# EAGLE design just_a_switch-mk-2.2 (EAGLE 6.5.0)
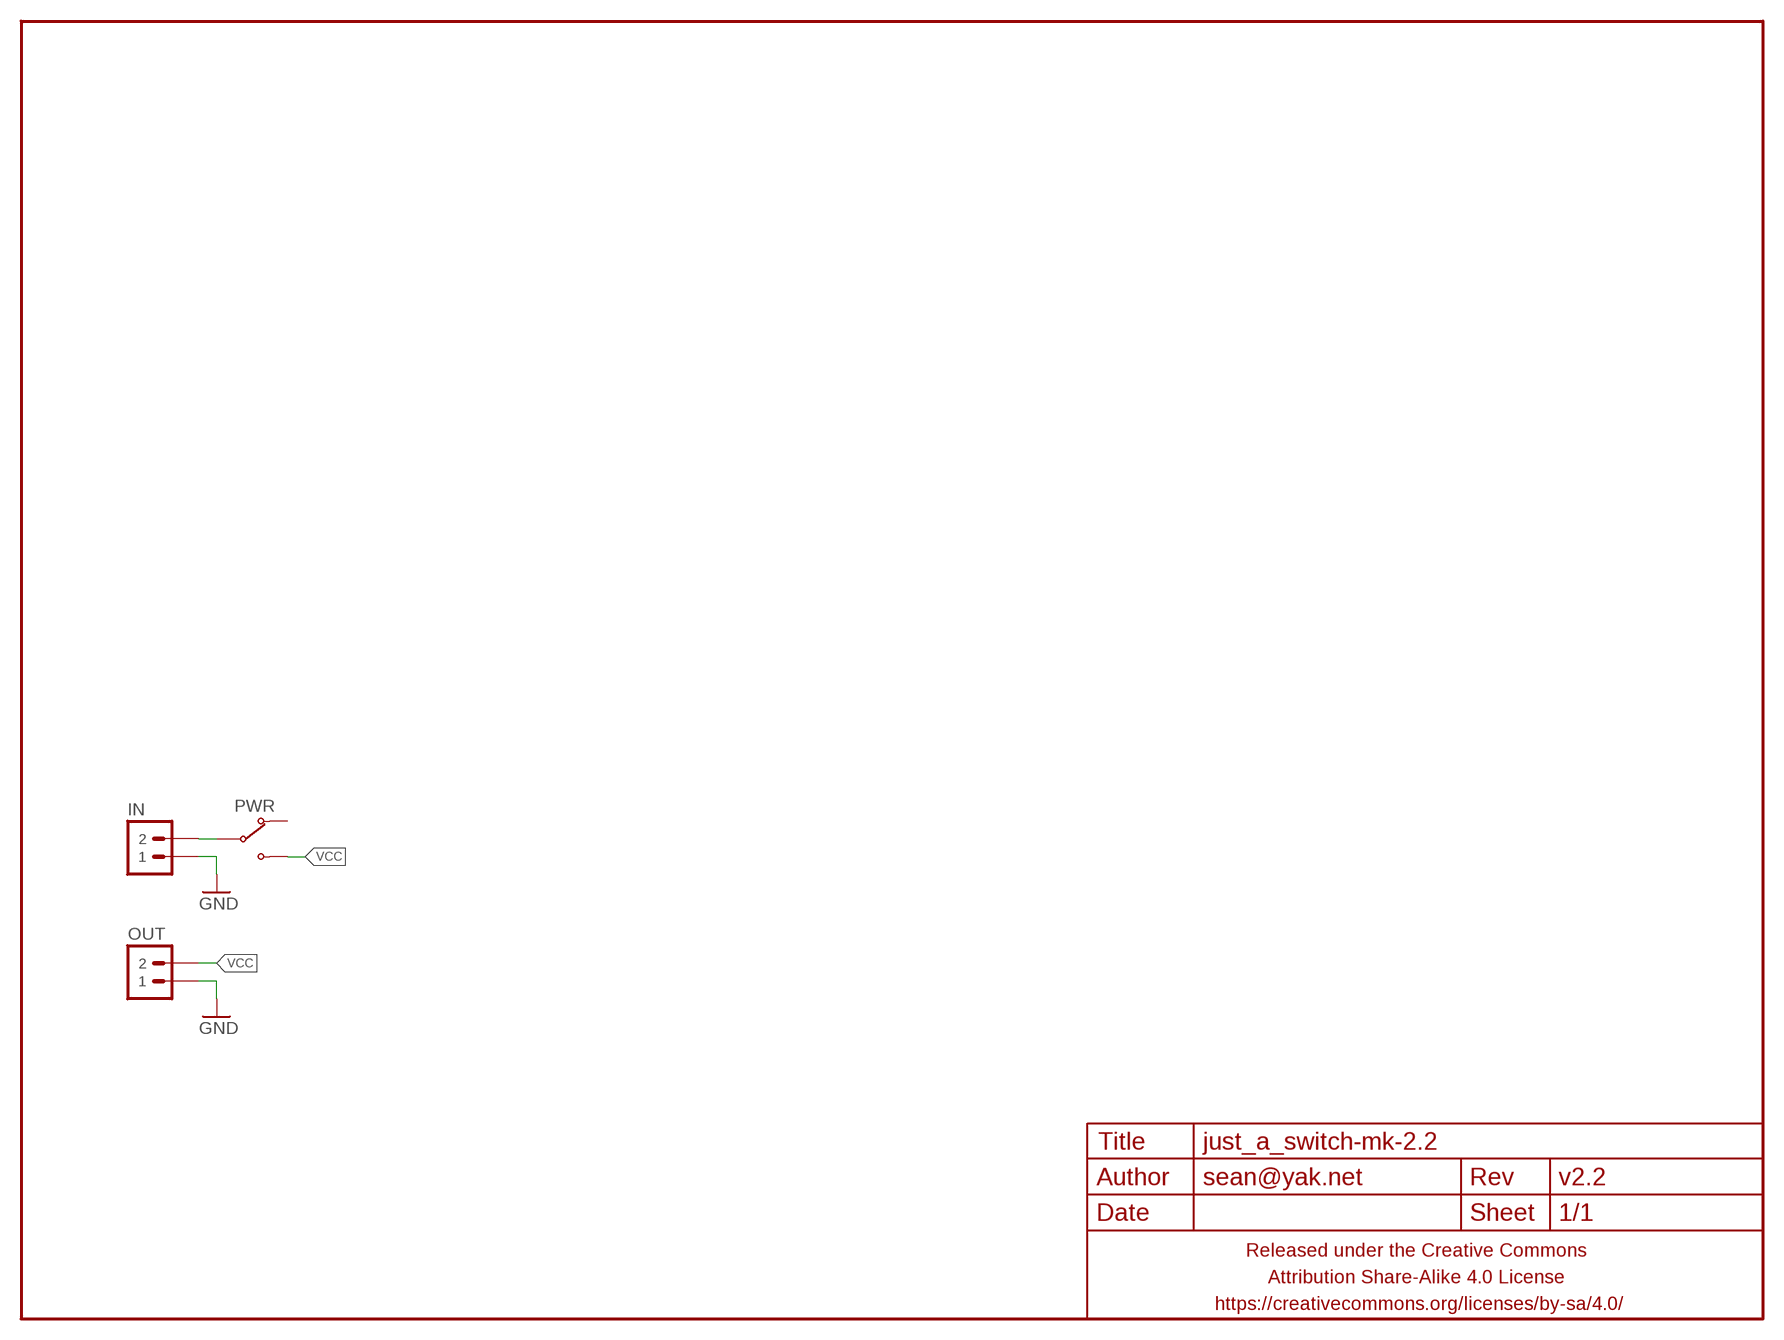
[diagram p0: schematic, sheet 1]

## Parts
FRAME1  FRAME-LETTERNO_PACKAGE  [DUMMY]
IN  M02JST-PH-VERT-R+  [JST-2-PH-VERT-PTH-R+]
OUT  M02JST-PH-VERT-R+  [JST-2-PH-VERT-PTH-R+]
PWR  SWITCH-SPDTPTH-RA-2.54MM  [SPDT-RA-2.54MM]

## Nets
GND: IN.1 OUT.1
N$1: IN.2 PWR.2(COM)
VCC: OUT.2 PWR.3(NO)
Unconnected: PWR.1(NC)

## Library data of the parts
FRAME1 = a_parts:FRAME-LETTER: Schematic Frame Standard 8.5x11 US Letter frame; DESIGNER: sean@yak.net; VERSION: v2.2
IN OUT = a_parts:M02: Standard 2-pin 0.1" header. Use with - straight break away headers ( PRT-00116) - right angle break away headers (PRT-00553) - swiss pins (PRT-00743) - machine pins (PRT-00117) - female headers (PRT-00115) Molex polarized connector foot print use with: PRT-08233 with associated crimp pins and housings. 2.54_SCREWTERM for use with PRT-10571. 3.5mm Screw Terminal footprints for PRT-08084 5mm Screw Terminal footprints for use with PRT-08433
PWR = a_parts:SWITCH-SPDT

## Board
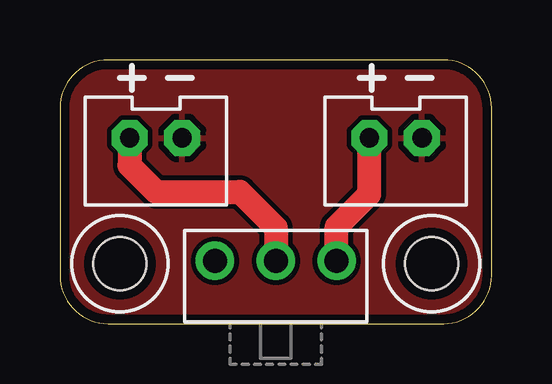
[diagram p1: board, top side]
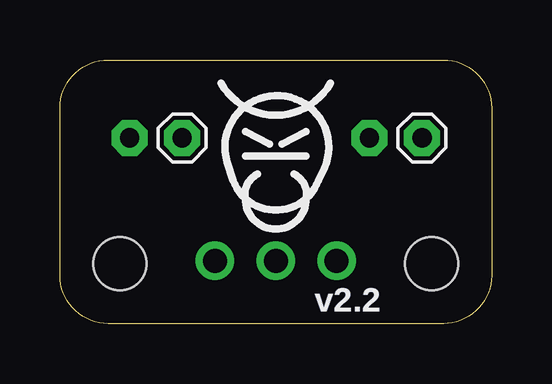
[diagram p2: board, bottom side, seen from below]

Size 18 x 11 mm. Coordinates in mm from the lower left corner, seen from the top.
Outline: 2,0 16,0 arc90 18,2 18,9 arc90 16,11 2,11 arc90 0,9 0,2 arc90 2,0
Copper layers (1*16): Top 0.0356mm / dielectric 1.5011mm / Bottom 0.0356mm
Design rules "LaenPCBOrder_2": minimum track width 6mil, minimum drill 13mil, track to track 6mil, track to pad 6mil, pad to pad 6mil, via to via 6mil, smd to smd 6mil, copper to edge 15mil, drill to drill 6mil, minimum pad ring 7mil, minimum via ring 7mil, stop-mask expansion 3mil, vias tented up to drill 20mil, thermal gap 10mil
Holes 2.2 mm at 2.5,2.5 15.5,2.5

### Footprints (pad centres in the part's own frame; a part is rotated, then mirrored left to right if it is on the bottom)
JST-2-PH-VERT-PTH-R+ = drill 0.8 pad 1.5 octagon: 1 -1.1,0; 2 1.1,0
SPDT-RA-2.54MM = drill 1 pad 1.6: 1 0,0; 2 2.54,0; 3 5.08,0

### Placement (x,y rotation side)
FRAME1  0,0 0 top
IN  4,7.75 180 top
OUT  14,7.75 180 top
PWR  6.46,2.62 0 top
U$1  [COW_SMALL_METAL_NOTEXT]  9,7.5 0 bottom

### Tracks (layer width: path | path; a pad name or v marks a point on that pad's centre or on a via)
GND
  pour Top (isolate 0.2): 2,11 16,11 arc-90 18,9 18,2 arc-90 16,0 2,0 arc-90 0,2 0,9 arc-90
N$1
  Top 1: IN.2 2.9,6.6 4,5.5 7.5,5.5 9,4 PWR.2
VCC
  Top 1: PWR.3 11.54,4.04 12.9,5.4 OUT.2